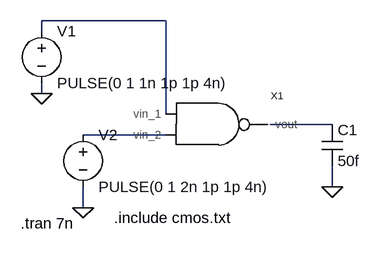
[diagram p0: schematic test.asc]
test.asc, the LTspice schematic file:
Version 4
SHEET 1 880 680
WIRE 144 16 -48 16
WIRE -48 32 -48 16
WIRE -48 128 -48 112
WIRE 144 160 144 16
WIRE 400 176 304 176
WIRE 144 192 16 192
WIRE 400 272 400 240
WIRE 16 304 16 272
FLAG -48 128 0
FLAG 16 304 0
FLAG 400 272 0
SYMBOL nand 224 176 R0
SYMATTR InstName X1
SYMBOL cap 384 176 R0
SYMATTR InstName C1
SYMATTR Value 50f
SYMBOL voltage -48 16 R0
WINDOW 123 0 0 Left 0
WINDOW 39 0 0 Left 0
SYMATTR InstName V1
SYMATTR Value PULSE(0 1 1n 1p 1p 4n)
SYMBOL voltage 16 176 R0
WINDOW 123 0 0 Left 0
WINDOW 39 0 0 Left 0
SYMATTR InstName V2
SYMATTR Value PULSE(0 1 2n 1p 1p 4n)
TEXT -80 328 Left 2 !.tran 7n
TEXT 64 320 Left 2 !.include cmos.txt

The netlist it stands for:
* test.asc
XX1 N002 N001 N003 nand  ; pins vout vin_1 vin_2
C1 N002 0 50f
V1 N001 0 PULSE(0 1 1n 1p 1p 4n)
V2 N003 0 PULSE(0 1 2n 1p 1p 4n)
.tran 7n
.include cmos.txt
.backanno
.end